# EAGLE design micromouse (EAGLE 9.0.1)
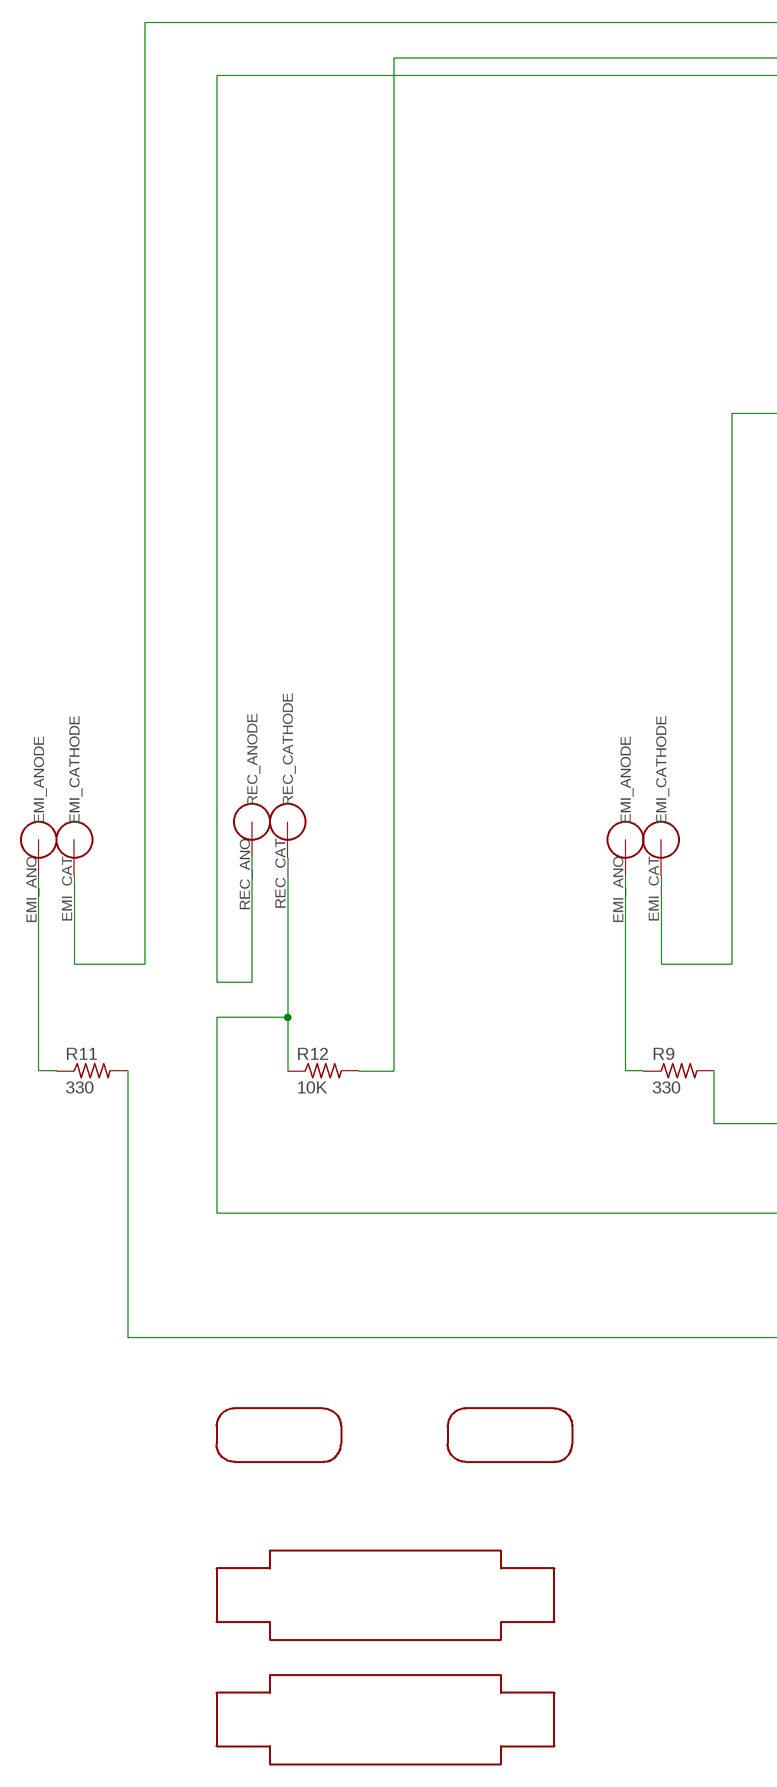
[diagram p0: schematic, sheet 1, part 1 of 2]
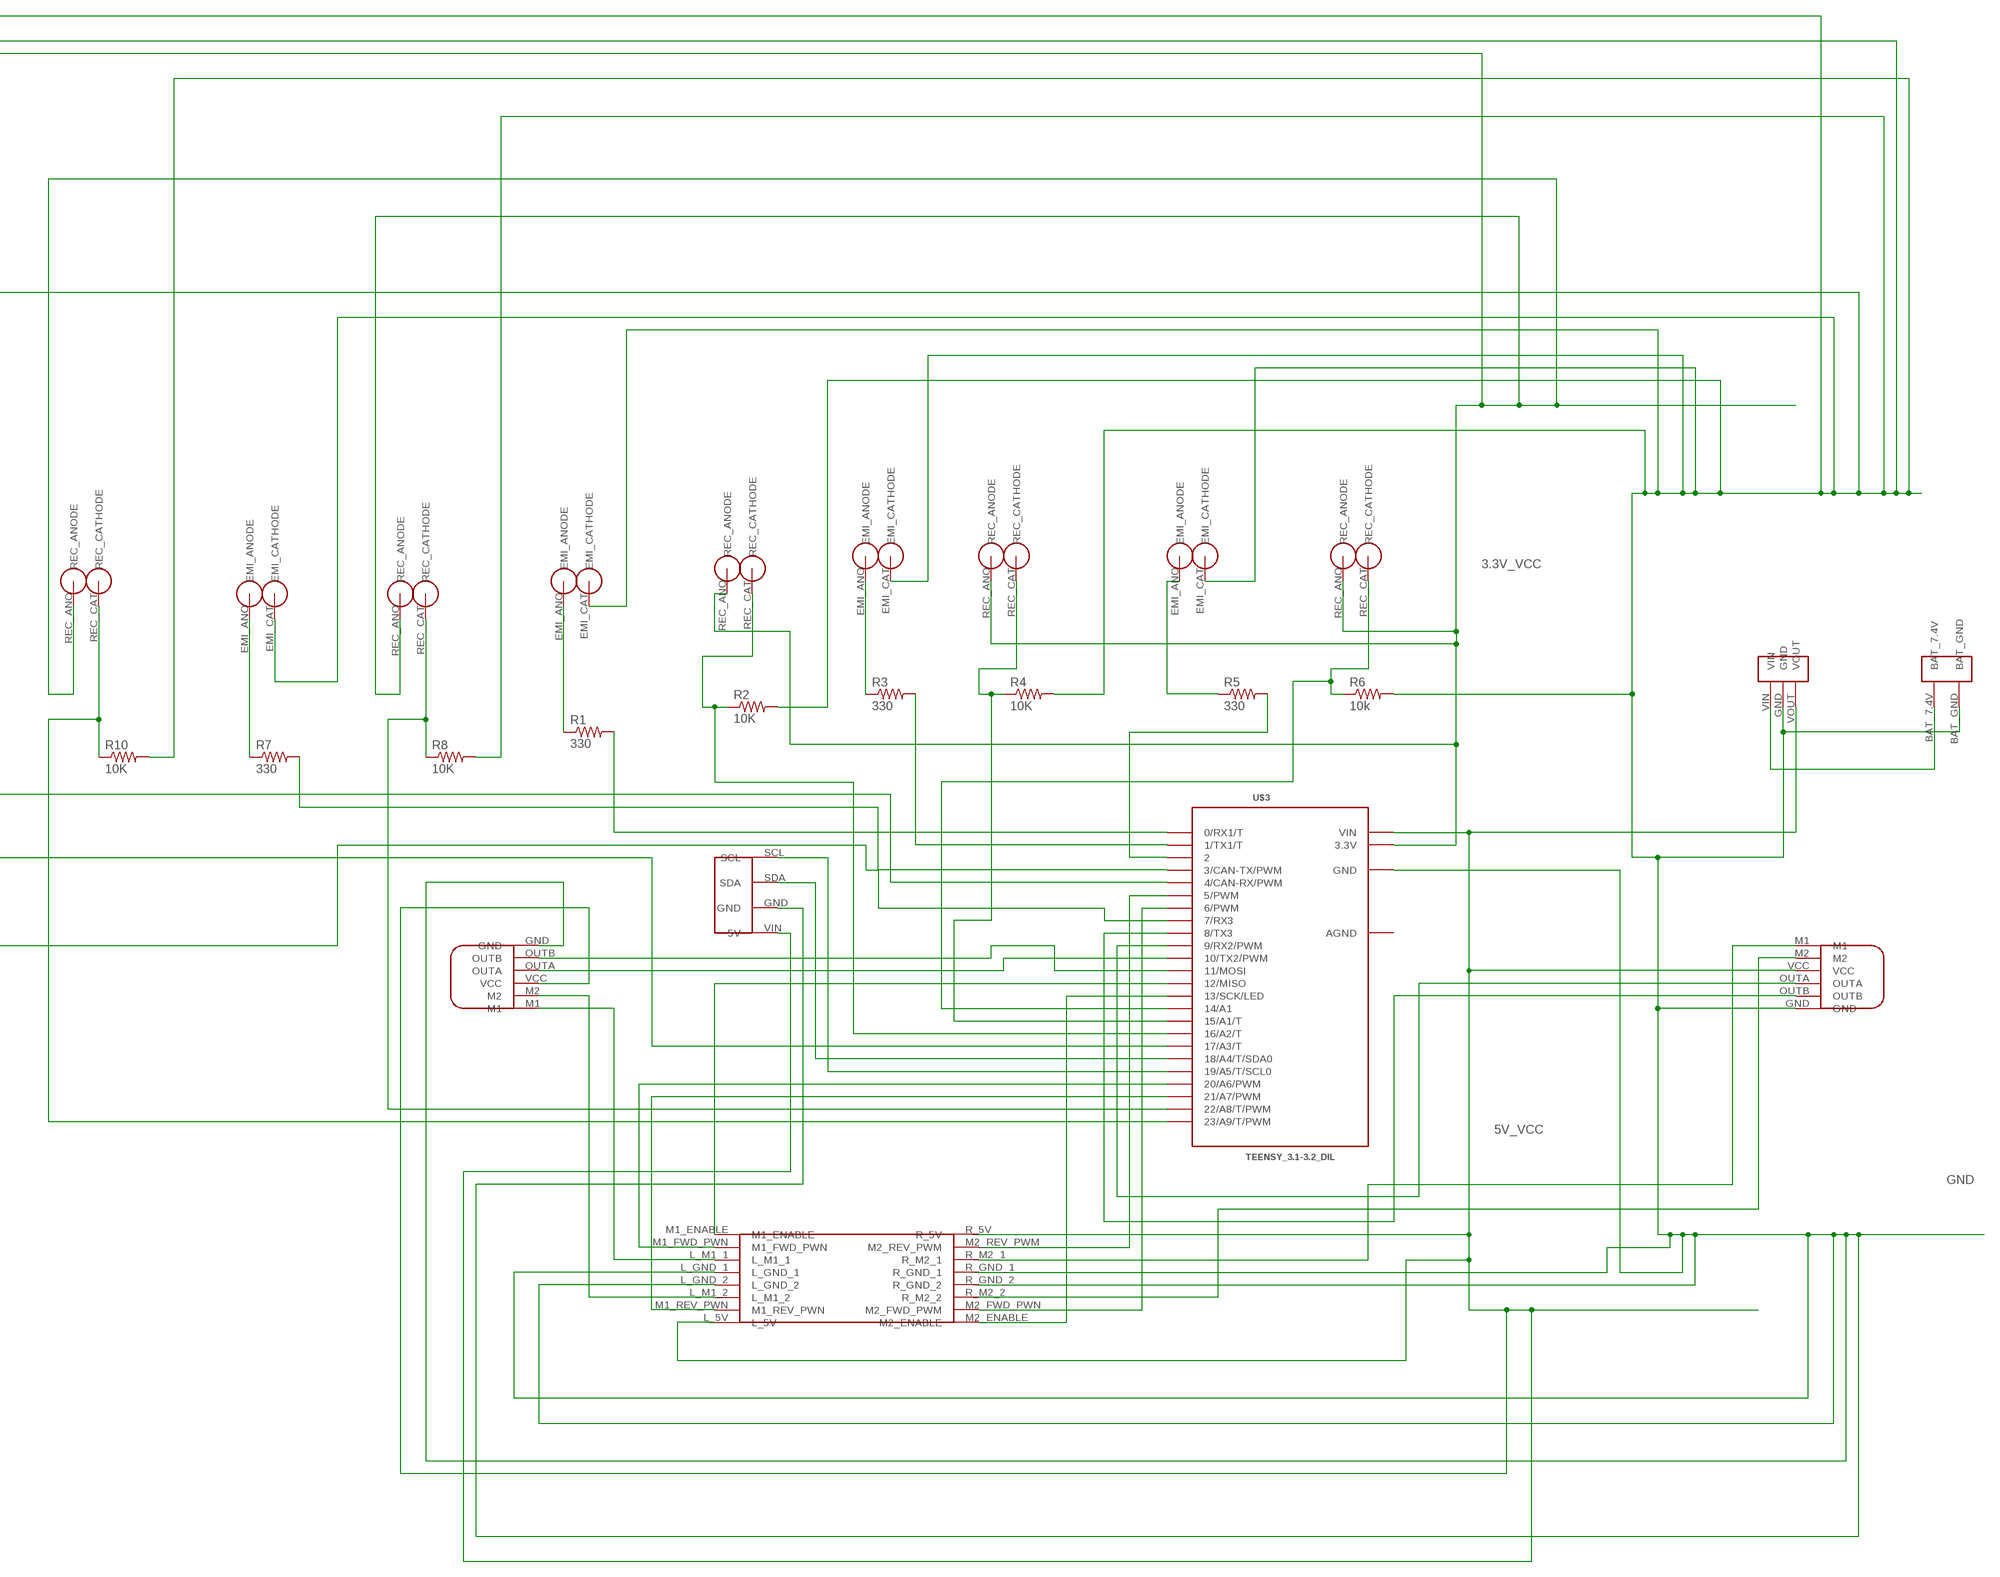
[diagram p1: schematic, sheet 1, part 2 of 2]

## Parts
R1  330  R-US_0207/10  [0207/10]
R2  10K  R-US_0207/10  [0207/10]
R3  330  R-US_0207/10  [0207/10]
R4  10K  R-US_0207/10  [0207/10]
R5  330  R-US_0207/10  [0207/10]
R6  10k  R-US_0207/10  [0207/10]
R7  330  R-US_0207/10  [0207/10]
R8  10K  R-US_0207/10  [0207/10]
R9  330  R-US_0207/10  [0207/10]
R10  10K  R-US_0207/10  [0207/10]
R11  330  R-US_0207/10  [0207/10]
R12  10K  R-US_0207/10  [0207/10]
U$1  MOTOR_ENCODER  [MOTOR_ENCODER]
U$2  MOTOR_ENCODER  [MOTOR_ENCODER]
U$3  TEENSY_3.1-3.2_DIL  [TEENSY_3.0-3.2&LC_DIL]
U$4  MOTOR_DRIVER  [MOTOR_DRIVER]
U$5  IR_RECIEVER  [IR_RECIEVER]
U$6  IR_EMITTER  [IR_EMITTER]
U$7  IR_EMITTER  [IR_EMITTER]
U$8  IR_RECIEVER  [IR_RECIEVER]
U$9  IR_EMITTER  [IR_EMITTER]
U$10  VOLTAGE_REGULATOR  [VOLTAGE_REGULATOR]
U$11  BATTERY_INPUT  [BATTERY_INPUT]
U$12  IR_RECIEVER  [IR_RECIEVER]
U$13  IMU  [IMU]
U$14  IR_EMITTER  [IR_EMITTER]
U$15  IR_RECIEVER  [IR_RECIEVER]
U$16  IR_EMITTER  [IR_EMITTER]
U$17  IR_RECIEVER  [IR_RECIEVER]
U$18  MOTOR_BRACKET  [MOTOR_BRACKET]
U$19  MOTOR_BRACKET  [MOTOR_BRACKET]
U$20  BALL_CASTER  [BALL_CASTER]
U$21  BALL_CASTER  [BALL_CASTER]
U$22  IR_EMITTER  [IR_EMITTER]
U$23  IR_RECIEVER  [IR_RECIEVER]

## Nets
3.3V_VCC: U$3.3.3V U$5.REC_ANO(REC_ANODE) U$8.REC_ANO(REC_ANODE) U$12.REC_ANO(REC_ANODE) U$15.REC_ANO(REC_ANODE) U$17.REC_ANO(REC_ANODE) U$23.REC_ANO(REC_ANODE)
5V_VCC: U$1.VCC U$2.VCC U$3.VIN U$4.L_5V U$4.R_5V U$10.VOUT U$13.VIN(5V)
GND: R2.2 R4.2 R6.2 R8.2 R10.2 R12.2 U$1.GND U$2.GND U$3.GND U$4.L_GND_1 U$4.L_GND_2 U$4.R_GND_1 U$4.R_GND_2 U$6.EMI_CAT(EMI_CATHODE) U$7.EMI_CAT(EMI_CATHODE) U$9.EMI_CAT(EMI_CATHODE) U$10.GND U$11.BAT_GND U$13.GND U$14.EMI_CAT(EMI_CATHODE) U$16.EMI_CAT(EMI_CATHODE) U$22.EMI_CAT(EMI_CATHODE)
M1_FWD_PWM: U$3.20/A6(20/A6/PWM) U$4.M1_FWD_PWN
M1_L: U$1.M1 U$4.L_M1_1
M1_R: U$2.M1 U$4.R_M2_1
M1_REV_PWM: U$3.21/A7(21/A7/PWM) U$4.M1_REV_PWN
M2_ENABLE: U$3.13(13/SCK/LED) U$4.M2_ENABLE
M2_FWD_PWM: U$3.6(6/PWM) U$4.M2_FWD_PWN(M2_FWD_PWM)
M2_L: U$1.M2 U$4.L_M1_2
M2_R: U$2.M2 U$4.R_M2_2
N$1: U$10.VIN U$11.BAT_7.4V
N$2: U$3.19/A5(19/A5/T/SCL0) U$13.SCL
N$3: U$3.18/A4(18/A4/T/SDA0) U$13.SDA
N$4: U$3.12(12/MISO) U$4.M1_ENABLE
N$5: U$3.5(5/PWM) U$4.M2_REV_PWM
N$6: R7.2 U$3.3(3/CAN-TX/PWM)
N$7: R7.1 U$14.EMI_ANO(EMI_ANODE)
N$8: R8.1 U$3.22/A8(22/A8/T/PWM) U$15.REC_CAT(REC_CATHODE)
N$9: R9.2 U$3.4(4/CAN-RX/PWM)
N$10: R9.1 U$16.EMI_ANO(EMI_ANODE)
N$11: R11.2 U$3.7(7/RX3)
N$12: R10.1 U$3.23/A9(23/A9/T/PWM) U$17.REC_CAT(REC_CATHODE)
N$13: R11.1 U$22.EMI_ANO(EMI_ANODE)
N$14: R12.1 U$3.17/A3(17/A3/T) U$23.REC_CAT(REC_CATHODE)
N$19: R1.2 U$3.0(0/RX1/T)
N$20: R1.1 U$9.EMI_ANO(EMI_ANODE)
N$21: R6.1 U$3.14/A0(14/A1) U$8.REC_CAT(REC_CATHODE)
N$22: R3.2 U$3.1(1/TX1/T)
N$23: R3.1 U$6.EMI_ANO(EMI_ANODE)
N$24: R4.1 U$3.15/A1(15/A1/T) U$12.REC_CAT(REC_CATHODE)
N$25: R5.2 U$3.2
N$26: R5.1 U$7.EMI_ANO(EMI_ANODE)
N$28: R2.1 U$3.16/A2(16/A2/T) U$5.REC_CAT(REC_CATHODE)
OUTA_L: U$1.OUTA U$3.10(10/TX2/PWM)
OUTA_R: U$2.OUTA U$3.9(9/RX2/PWM)
OUTB_L: U$1.OUTB U$3.11(11/MOSI)
OUTB_R: U$2.OUTB U$3.8(8/TX3)

## Power pins joined to a net without a drawn wire
AGND: U$3.AGND

## Library data of the parts
R1-R12 = rcl:R-US_: RESISTOR, American symbol; SPICEPREFIX: R
U$1 U$2 = MOTOR_ENCODER:MOTOR_ENCODER
U$3 = Teensy_3_and_LC_Series_Boards_v1.4:TEENSY_3.1-3.2_DIL: Teensy 3.1 or 3.2 in a DIL Layout.
U$4 = motor_driver:MOTOR_DRIVER
U$5 U$8 U$12 U$15 U$17 U$23 = IR_RECIEVER:IR_RECIEVER
U$6 U$7 U$9 U$14 U$16 U$22 = IR_EMITTER:IR_EMITTER
U$10 = VOLTAGE_REGULATOR:VOLTAGE_REGULATOR
U$11 = Battery_input:BATTERY_INPUT
U$13 = IMU:IMU
U$18 U$19 = MOTOR_BRACKET:MOTOR_BRACKET
U$20 U$21 = BALL_CASTER:BALL_CASTER

## Board
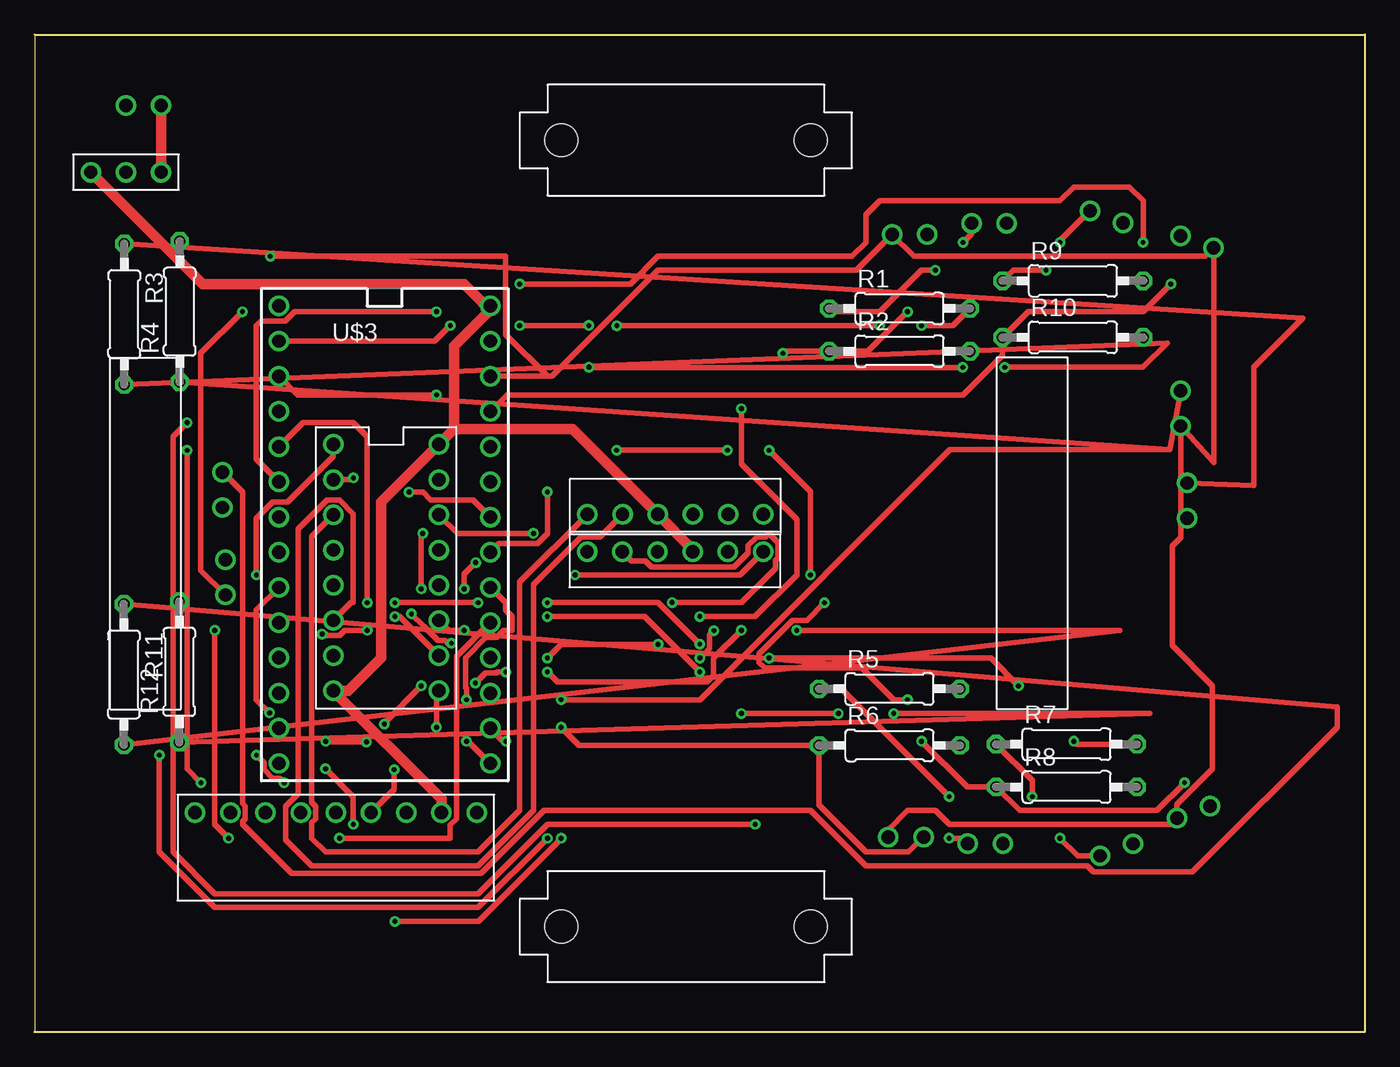
[diagram p2: board, top side]
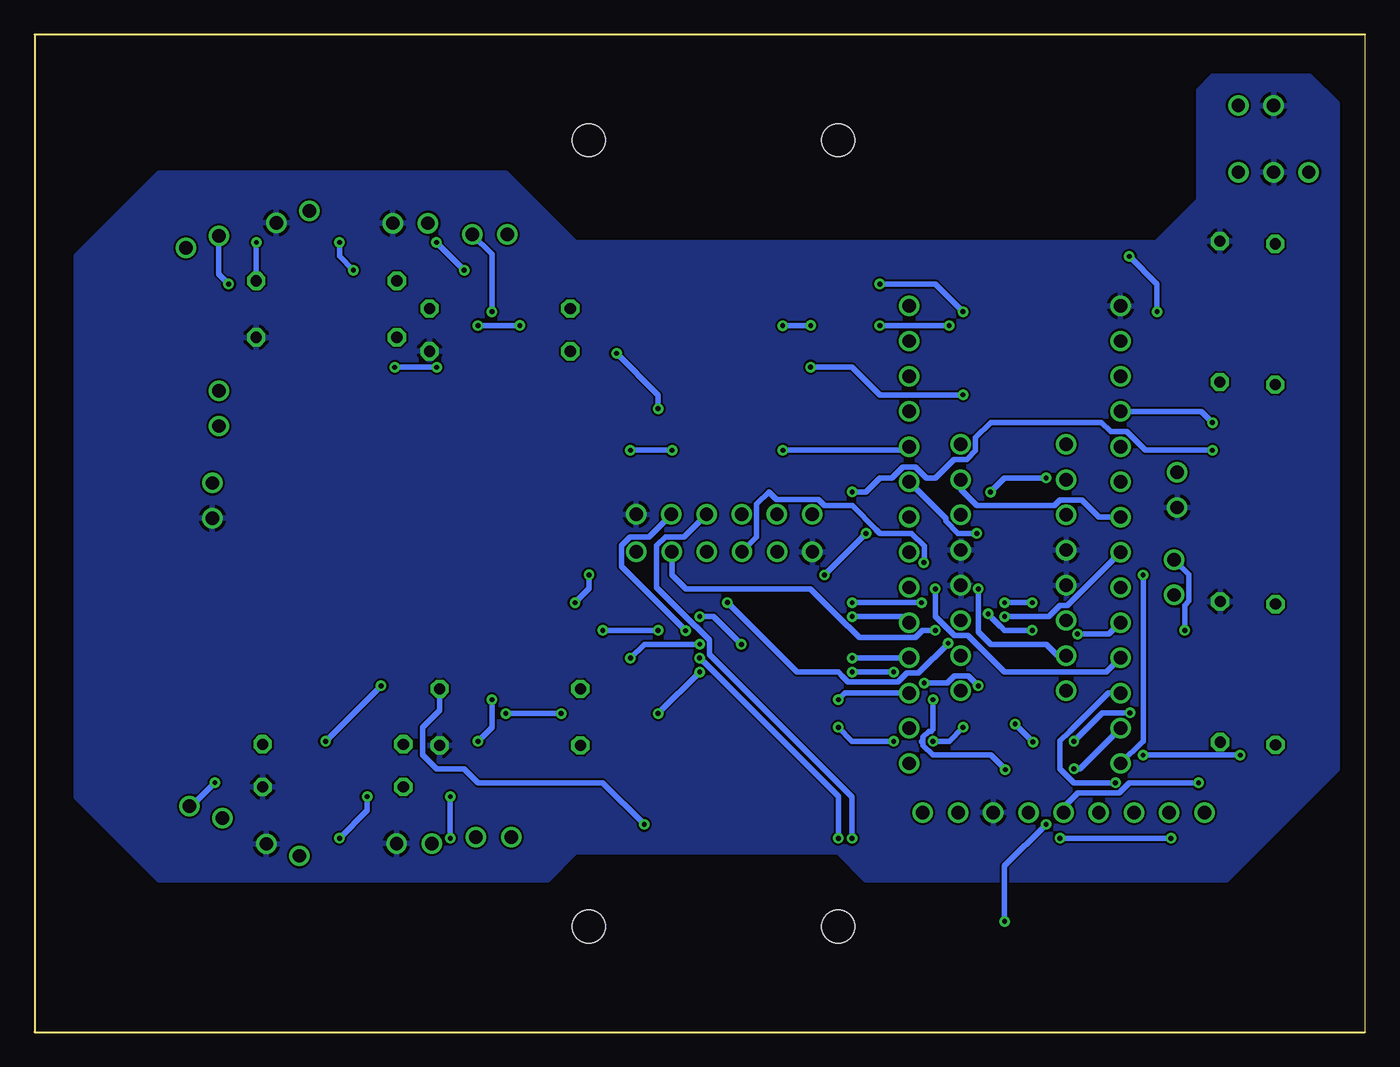
[diagram p3: board, bottom side, seen from below]

Size 96 x 72 mm. Coordinates in mm from the lower left corner, seen from the top.
Outline: 0,72 0,0 96,0 96,72 0,72
Copper layers (1*16): Top 0.035mm / dielectric 1.5mm / Bottom 0.035mm
Design rules "default": minimum track width 6mil, minimum drill 0.35mm, track to track 6mil, track to pad 6mil, pad to pad 6mil, via to via 6mil, smd to smd 6mil, copper to edge 40mil, drill to drill 6mil, minimum pad ring 10mil, minimum via ring 8mil, stop-mask expansion 4mil, vias tented up to drill 0mil, thermal gap 10mil

### Footprints (pad centres in the part's own frame; a part is rotated, then mirrored left to right if it is on the bottom)
0207/10 = drill 0.813 octagon: 1 -5.08,0; 2 5.08,0
MOTOR_ENCODER = drill 0.965: GND -1.27,3.81; M1 -1.27,-8.89; M2 -1.27,-6.35; OUTA -1.27,-1.27; OUTB -1.27,1.27; VCC -1.27,-3.81
TEENSY_3.0-3.2&LC_DIL = drill 0.965: 0 -7.62,13.97; 1 -7.62,11.43; 2 -7.62,8.89; 3 -7.62,6.35; 3.3V 7.62,11.43; 4 -7.62,3.81; 5 -7.62,1.27; 6 -7.62,-1.27; 7 -7.62,-3.81; 8 -7.62,-6.35; 9 -7.62,-8.89; 10 -7.62,-11.43; 11 -7.62,-13.97; 12 -7.62,-16.51; 13 7.62,-16.51; 14/A0 7.62,-13.97; 15/A1 7.62,-11.43; 16/A2 7.62,-8.89; 17/A3 7.62,-6.35; 18/A4 7.62,-3.81; 19/A5 7.62,-1.27; 20/A6 7.62,1.27; 21/A7 7.62,3.81; 22/A8 7.62,6.35; 23/A9 7.62,8.89; AGND 7.62,13.97; GND -7.62,16.51; VIN 7.62,16.51
MOTOR_DRIVER = drill 0.965: L_5V -3.81,-11.43; L_GND_1 -3.81,-1.27; L_GND_2 -3.81,-3.81; L_M1_1 -3.81,1.27; L_M1_2 -3.81,-6.35; M1_ENABLE -3.81,6.35; M1_FWD_PWN -3.81,3.81; M1_REV_PWN -3.81,-8.89; M2_ENABLE 3.81,-11.43; M2_FWD_PWN 3.81,-8.89; M2_REV_PWM 3.81,3.81; R_5V 3.81,6.35; R_GND_1 3.81,-1.27; R_GND_2 3.81,-3.81; R_M2_1 3.81,1.27; R_M2_2 3.81,-6.35
IR_RECIEVER = drill 0.965: REC_ANO -1.27,0; REC_CAT 1.27,0
IR_EMITTER = drill 0.965: EMI_ANO -1.27,0; EMI_CAT 1.27,0
VOLTAGE_REGULATOR = drill 0.965: GND 0,0; VIN 2.54,0; VOUT -2.54,0
BATTERY_INPUT = drill 0.965: BAT_7.4V -1.27,0; BAT_GND 1.27,0
IMU = drill 0.965: GND -1.27,0; NO_USE_1 -1.27,5.08; NO_USE_2 -1.27,-7.62; NO_USE_3 -1.27,-10.16; NO_USE_4 -1.27,-12.7; NO_USE_5 -1.27,-15.24; SCL -1.27,-5.08; SDA -1.27,-2.54; VIN -1.27,2.54
MOTOR_BRACKET = hole 2.382: -9,0; 9,0

### Placement (x,y rotation side)
R1  62.42,52.23 0 top
R2  62.42,49.15 0 top
R3  6.47,51.82 270 top
R4  10.47,52.01 90 top
R5  61.69,24.78 0 top
R6  61.69,20.7 0 top
R7  74.47,20.78 0 top
R8  74.47,17.7 0 top
R9  74.93,54.23 0 top
R10  74.93,50.15 0 top
R11  6.44,25.82 270 top
R12  10.44,26.01 90 top
U$1  48.78,36.1 270 top
U$2  43.68,35.94 90 top
U$3  25.26,35.91 0 top
U$4  25.36,36.07 0 top
U$5  63.15,57.58 0 top
U$6  83.17,38.37 270 top
U$7  68.61,13.62 0 top
U$8  62.88,14.08 0 top
U$9  68.88,58.39 0 top
U$10  6.59,62.07 0 top
U$11  7.86,66.88 180 top
U$12  82.71,45.02 90 top
U$13  26.82,14.59 270 top
U$14  78.09,13.16 20 top
U$15  83.63,15.89 20 top
U$16  77.36,58.85 340 top
U$17  83.9,57.04 160 top
U$18  47,7.62 0 top
U$19  47,64.38 0 top
U$20  72,36 270 top
U$21  8,36 90 top
U$22  13.55,39.14 270 top
U$23  13.78,32.83 90 top

### Tracks (layer width: path | path; a pad name or v marks a point on that pad's centre or on a via)
3.3V_VCC  (via drill 0.35)
  Top 0.381: U$8.REC_ANO 61.61,14.61 63,16 65,16 66,15 81.98,15 U$15.REC_ANO 82.44,16.44 85,19 85,25 82.09,27.91 82.09,35.09 82.71,35.71 U$12.REC_ANO 85.09,41.13 U$17.REC_ANO 84.49,56 63.46,56 U$5.REC_ANO 59.3,55 45,55 37.34,47.34 37,47.34 | 37,47.34 U$3.3.3V | 37,47.34 34,50.34 34,56 v17,56 | v15,52 12,49 12,33.34 U$23.REC_ANO
  Bottom 0.381: v17,56 15,54 v15,52
5V_VCC
  Top 0.762: U$10.VOUT 12.12,54 31,54 32.88,52.12 | 32.88,52.12 U$3.VIN | 29,42.59 U$4.R_5V | U$2.VCC 47.49,34.85 U$1.VCC 38.81,43.53 30.28,43.53 | U$4.R_5V 25,38.25 25,27 22.64,24.64 U$4.L_5V 29.36,16.83 U$13.VIN | U$4.R_5V 30.28,43.53 | 30.28,43.53 30.28,49.52 32.88,52.12
GND
  pour Bottom: 2,67 2,19 10,11 36,11 38,13 57,13 59,11 87,11 93,17 93,56 87,62 76,62 62,62 57,57 15,57 12,60 12,68 11,69 5,69 4,69
M1_FWD_PWM  (via drill 0.35)
  Top 0.381: U$4.M1_FWD_PWN 22.88,39.88 v23,40 | v27.02,38.98 28.02,38.98 28.58,38.42 31.64,38.42 U$3.20/A6
  Bottom 0.381: v23,40 26,40 v27.02,38.98
M1_L
  Top 0.381: U$1.M1 35,32.48 35,16 32,13 21,13 20,14 20,15.13 20.28,15.41 20.28,16.31 20,16.59 20,35.79 U$4.L_M1_1
M1_R  (via drill 0.35)
  Top 0.381: U$2.M1 50.9,33 v39,33 | U$4.R_M2_1 30.51,36 v36,36
  Bottom 0.381: v39,33 v36,36
M1_REV_PWM  (via drill 0.35)
  Top 0.381: v28,36 27.9,35.9 v27.9,32
  Bottom 0.381: v27.9,32 27.9,28.9 27,28 23,28 22.18,27.18 U$4.M1_REV_PWN | v28,36 29.36,36 30.25,36.89 30.25,37.09 U$3.21/A7
M2_ENABLE  (via drill 0.35)
  Top 0.381: U$3.13 31.28,21 v31.16,21 | U$4.M2_ENABLE 29,24.47 v29,22
  Bottom 0.381: v31.16,21 30,21 v29,22
M2_FWD_PWM  (via drill 0.35)
  Top 0.381: v26,30 26.35,30 U$4.M2_FWD_PWN
  Bottom 0.381: U$3.6 21.48,30.8 22,30.8 22.8,30 v26,30
M2_L
  Top 0.381: U$1.M2 40.81,35.75 39.42,35.75 36,32.33 36,16 32,12 20,12 18.12,13.88 18.12,16.31 19,17.19 19,36.32 21.1,38.42 22,38.42 23,37.42 23,31 22.83,31 U$4.L_M1_2
M2_R  (via drill 0.35)
  Top 0.381: v31,29 29.89,29 U$4.R_M2_2
  Bottom 0.381: U$2.M2 50,34.64 50,33 49,32 40,32 37.72,29.72 37.72,29.7 37.3,29.28 37.28,29.28 36.48,28.48 32.43,28.48 31.91,29 v31,29
N$1
  Top 0.762: U$11.BAT_7.4V U$10.VIN
N$2  (via drill 0.35)
  Top 0.381: v12,18 11,19 v11,42 | U$3.19/A5 33.52,35.28 36.3,35.28 37,35.98 v37,39
  Bottom 0.381: U$13.SCL 21.74,16.26 20.72,17.28 17.7,17.28 16.98,18 v12,18 | v11,42 15.85,42 17.19,43.34 18.34,43.34 19,44 27,44 28.09,42.91 28.09,41.97 28.72,41.34 29.66,41.34 31,40 31.63,40 32.43,40.8 33.33,40.8 34.13,40 35,40 36,39 v37,39
N$3  (via drill 0.35)
  Top 0.381: U$13.SDA 25.95,17.53 v25.95,18.95 | v31.16,24 31.16,24.82 31.08,24.9 31.08,27.01 32.55,28.48 33.33,28.48 33.85,29 34.47,29 34.47,30 34,30.47 34,31 32.9,32.1 U$3.18/A4
  Bottom 0.381: v25.95,18.95 27,20 31.18,20 31.88,20.7 31.88,20.88 32,21 31.88,21.12 31.88,21.3 31.46,21.72 31.28,21.72 31.16,21.84 v31.16,24
N$4  (via drill 0.35)
  Top 0.381: v16,33 16,37.07 17.19,38.26 18.26,38.26 21.55,41.55 U$4.M1_ENABLE
  Bottom 0.381: U$3.12 16.04,21 16,21 v16,33
N$5
  Bottom 0.381: U$3.5 19.18,37.18 20.42,38.42 22,38.42 22.42,38 28,38 29.17,39.17 U$4.M2_REV_PWM
N$6  (via drill 0.35)
  Top 0.381: R7.2 75.22,20.78 v75,21 | v71,25 69,27 v53,27 | v48,28 45,31 v37,31 | v24,31 24,43 23,44 19.38,44 U$3.3 | v32,31 v26,31
  Bottom 0.381: v75,21 v71,25 | v53,27 52,28 v48,28 | v26,31 v24,31 | v37,31 v32,31
N$7  (via drill 0.35)
  Top 0.381: U$14.EMI_ANO 75.27,12.73 v74,14 | v72,17 72,18.17 R7.1
  Bottom 0.381: v74,14 72,16 v72,17
N$8  (via drill 0.35)
  Top 0.381: v82.99,18.01 81,16.02 81,16 71.09,16 R8.1 67.3,17.7 v64,21 | v63,24 62,24 59.72,26.28 52.7,26.28 52.28,26.7 52.28,27.3 54.7,29.72 55.72,29.72 v57,31 | v55.99,33.01 55.99,39.01 v53,42 | v50,42 v42,42
  Bottom 0.381: v82.99,18.01 84.68,16.32 U$15.REC_CAT | v64,21 63,22 v63,24 | v57,31 55.99,32.01 v55.99,33.01 | v53,42 v50,42 | v42,42 33.14,42 U$3.22/A8
N$9  (via drill 0.35)
  Top 0.381: U$3.4 16,41.36 16,51 16.34,51.34 18.09,51.34 18.75,52 v29,52 | v35,54 43,54 45,56 59,56 60,57 60,59 61,60 74,60 75,61 79,61 80,60 v80,57
  Bottom 0.381: v29,52 31,54 v35,54 | v80,57 R9.2
N$10  (via drill 0.35)
  Top 0.381: R9.1 70.62,55 v73,55 | v74,57 74,57.12 U$16.EMI_ANO
  Bottom 0.381: v73,55 74,56 v74,57
N$11  (via drill 0.35)
  Top 0.381: R11.2 78.3,29 v55,29 | v51,29 49,27 49,25.75 48.52,25.28 37.72,25.28 v37,26 | v34,26 33.39,26 33.33,25.94 32.55,25.94 v31.8,25.2 | v27.9,25 25.24,22.34 v25.24,22.24 | v23.95,20.95 21.05,20.95 v21,21 | v16.95,23.05 16,24 16,30.46 U$3.7
  Bottom 0.381: v55,29 v51,29 | v37,26 v34,26 | v31.8,25.2 30.14,25.2 29.62,25.72 28.62,25.72 v27.9,25 | v21,21 18.95,23.05 v16.95,23.05 | v25.24,22.24 v23.95,20.95
N$12  (via drill 0.35)
  Top 0.381: U$3.23/A9 34.08,46 67,46 69.85,48.85 R10.1 71.7,52 80,52 v82,54
  Bottom 0.381: v82,54 82.71,54.71 U$17.REC_CAT
N$13
  Top 0.381: R11.1 94,23.46 94,22 83.56,11.56 76.41,11.56 75.97,12 60,12 56,16 36.75,16 32.22,11.47 18.53,11.47 15,15 15,15.21 15.2,15.41 15.2,16.31 15,16.51 15,39 13.59,40.41 U$22.EMI_ANO
N$14  (via drill 0.35)
  Top 0.381: R12.1 80.49,23 v62,23 | v58,23 v51,23 | v48,26 44,30 v37,30 | U$3.17/A3 30.44,27.12 30.44,15.41 30,14.97 30,14 v22,14 | v14,14 13,15 v13,29
  Bottom 0.381: v62,23 v58,23 | v51,23 v48,26 | v37,30 33.32,30 U$3.17/A3 | v22,14 v14,14 | v13,29 13,30.81 12.7,31.11 12.7,33.02 U$23.REC_CAT
N$19  (via drill 0.35)
  Top 0.381: U$3.0 28.88,49.88 v30,51 | v35,51 v39.98,51 v39.99,51.01 | v42.01,50.99 60.97,50.99 v60.99,51.01 | v64,51 66.27,51 R1.2
  Bottom 0.381: v30,51 v35,51 | v39.99,51.01 41.99,51.01 v42.01,50.99 | v60.99,51.01 v63.99,51.01 v64,51
N$20  (via drill 0.35)
  Top 0.381: U$9.EMI_ANO 67.61,57.61 v67,57 | v65,55 64,55 61,52 57.57,52 R1.1
  Bottom 0.381: v67,57 v65,55
N$21  (via drill 0.35)
  Top 0.381: U$8.REC_CAT 63.07,13 60,13 56.61,16.39 R6.1 39.3,20.7 v38,22 | v34,21 33.82,21 U$3.14/A0
  Bottom 0.381: v38,22 37,21 v34,21
N$22  (via drill 0.35)
  Top 0.381: R3.2 81.74,49.74 79.99,47.99 v70.01,47.99 | v66.98,47.98 40.02,47.98 v40,48 | v29,46 18.98,46 U$3.1
  Bottom 0.381: v70.01,47.99 v66.99,47.99 v66.98,47.98 | v40,48 37,48 35,46 v29,46
N$23
  Top 0.381: U$6.EMI_ANO 88,39.47 88,48 91.53,51.53 R3.1
N$24  (via drill 0.35)
  Top 0.381: R4.1 81.93,42.07 | 81.93,42.07 U$12.REC_CAT | 81.93,42.07 66.07,42.07 48,24 v38,24
  Bottom 0.381: v38,24 37.52,24.48 U$3.15/A1
N$25  (via drill 0.35)
  Top 0.381: v52,15 37,15 32,10 13,10 10,13 10,43 v11,44
  Bottom 0.381: R5.2 66.77,23.23 68,22 68,20 67,19 65,19 64,18 55,18 v52,15 | v11,44 11.8,44.8 U$3.2
N$26  (via drill 0.35)
  Top 0.381: U$7.EMI_ANO 66.96,14 v66,14 | v66,17 58.22,24.78 R5.1
  Bottom 0.381: v66,14 v66,17
N$28  (via drill 0.35)
  Top 0.381: v63,52 60.15,49.15 R2.1 54.15,49.15 v54,49 | v51,45 51,41 55,37 55,33 52,30 v48,30 | v44.99,27.99 37.99,27.99 v37,27
  Bottom 0.381: U$5.REC_CAT 63,56.16 v63,52 | v54,49 51,46 v51,45 | v48,30 47,30 v44.99,27.99 | v37,27 32.9,27 U$3.16/A2
OUTA_L  (via drill 0.35)
  Top 0.381: v37.01,13.99 32.02,9 13,9 9,13 v9,20 | v16,20 16.56,19.44 16.56,18.95 17.19,18.32 17.68,18.32 v18,18
  Bottom 0.381: U$1.OUTA 49.13,35.75 50.48,35.75 51.11,35.12 51.11,32.09 48.3,29.28 48.26,29.28 47.28,28.3 47.28,27.28 37,17 v37,14 v37.01,13.99 | v9,20 v16,20 | v18,18 21,18 22,19 22,21.02 21.3,21.72 21.28,21.72 18.52,24.48 U$3.10
OUTA_R  (via drill 0.35)
  Top 0.381: v31.83,33.9 31,33.07 v31,32
  Bottom 0.381: U$2.OUTA 43.89,35.73 43.89,38.11 43,39 42.45,38.45 39.44,38.45 38.99,38 36.98,38 35.28,36.3 35.28,36.28 35,36 32.71,36 31.8,35.09 31.8,34.19 31.83,34.17 v31.83,33.9 | v31,32 31,30.02 29.62,28.64 28.64,28.64 26,26 18.66,26 U$3.9
OUTB_L  (via drill 0.35)
  Top 0.381: v49.02,28.98 48.72,28.68 48.72,27.7 48.3,27.28 48.28,27.28 v48.01,27.01 | v38,14 37.73,13.73 37.73,13.69 32.04,8 v26,8 | v23,15 23,17 v20.99,19.01
  Bottom 0.381: U$1.OUTB 51.67,35.75 53.02,35.75 53.65,35.12 53.65,34 53.65,33.61 v49.02,28.98 | v48.01,27.01 47.72,26.72 47.7,26.72 38,17.02 v38,14 | v26,8 26,12 v23,15 | v20.99,19.01 20.57,19.01 U$3.11
OUTB_R  (via drill 0.35)
  Top 0.381: v20.74,28.74 21,28.74 21.1,28.64 22,28.64 22.36,29 v24,29 | v27.18,30.19 28.09,29.28 28.09,29.27 29.1,28.26 29.62,28.26 29.88,28 30,28 v30.07,28.07 | v46.01,31.01 51.01,31.01 53.47,33.47 53.47,34.04 53.65,34.22 53.65,35.35 53,36 52.75,35.75 52.12,35.75 51.49,35.12 51.49,34.6 50.48,33.59 44.5,33.59 44.09,34 43.08,34 U$2.OUTB
  Bottom 0.381: v24,29 26,29 26.28,29.28 26.3,29.28 27.18,30.16 v27.18,30.19 | v20.74,28.74 18.46,28.74 U$3.8 | v30.07,28.07 32.2,25.94 33.04,25.94 33.7,25.28 37.3,25.28 37.72,25.7 37.72,25.72 38,26 41,26 v46.01,31.01